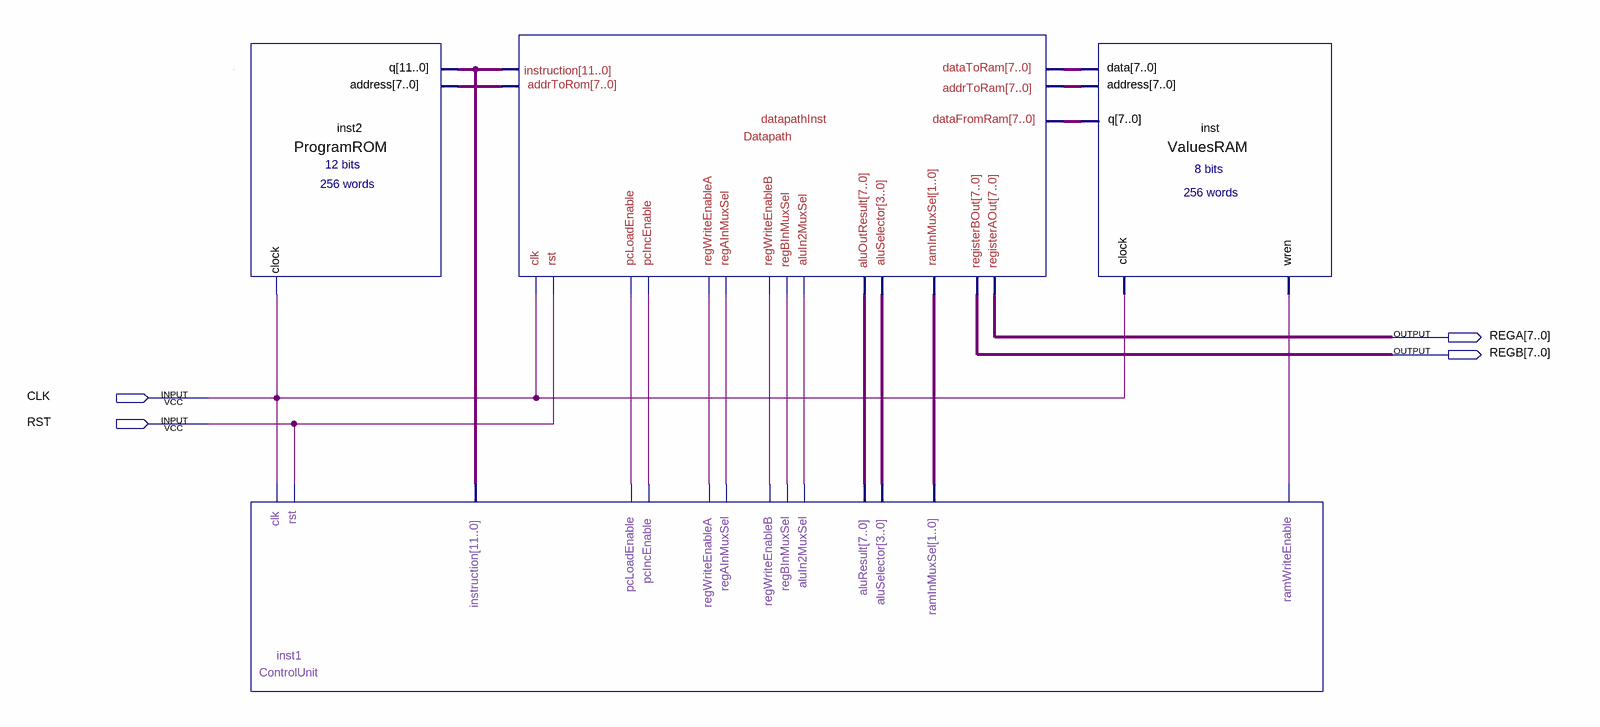
[diagram p0: schematic sheet]
// Quartus schematic TinyCore8.bdf as structural Verilog: 4 symbols, 4 pins
module TinyCore8 (
  input  CLK,
  input  RST,
  output [7:0] REGA,
  output [7:0] REGB
);

  wire inst1_aluin2muxsel, inst1_pcincenable, inst1_pcloadenable, inst1_ramwriteenable, inst1_regainmuxsel,
       inst1_regbinmuxsel, inst1_regwriteenablea, inst1_regwriteenableb;
  wire [1:0] inst1_raminmuxsel;
  wire [3:0] inst1_aluselector;
  wire [7:0] datapathInst_addrtoram, datapathInst_addrtorom, datapathInst_aluoutresult,
       datapathInst_datatoram, inst_q;
  wire [11:0] inst2_q;

  ProgramROM inst2 (.address(datapathInst_addrtorom), .clock(CLK), .q(inst2_q));
  ControlUnit inst1 (
    .instruction(inst2_q), .aluResult(datapathInst_aluoutresult), .clk(CLK), .rst(RST),
    .pcLoadEnable(inst1_pcloadenable), .pcIncEnable(inst1_pcincenable),
    .regWriteEnableA(inst1_regwriteenablea), .regWriteEnableB(inst1_regwriteenableb),
    .regAInMuxSel(inst1_regainmuxsel), .regBInMuxSel(inst1_regbinmuxsel), .aluIn2MuxSel(inst1_aluin2muxsel),
    .ramInMuxSel(inst1_raminmuxsel), .ramWriteEnable(inst1_ramwriteenable), .aluSelector(inst1_aluselector));
  Datapath datapathInst (
    .clk(CLK), .rst(RST), .instruction(inst2_q), .dataFromRam(inst_q), .pcLoadEnable(inst1_pcloadenable),
    .pcIncEnable(inst1_pcincenable), .regWriteEnableA(inst1_regwriteenablea),
    .regWriteEnableB(inst1_regwriteenableb), .regAInMuxSel(inst1_regainmuxsel),
    .regBInMuxSel(inst1_regbinmuxsel), .aluIn2MuxSel(inst1_aluin2muxsel), .ramInMuxSel(inst1_raminmuxsel),
    .aluSelector(inst1_aluselector), .addrToRom(datapathInst_addrtorom), .addrToRam(datapathInst_addrtoram),
    .dataToRam(datapathInst_datatoram), .aluOutResult(datapathInst_aluoutresult), .registerAOut(REGA),
    .registerBOut(REGB));
  ValuesRAM inst (
    .data(datapathInst_datatoram), .wren(inst1_ramwriteenable), .address(datapathInst_addrtoram),
    .clock(CLK), .q(inst_q));
endmodule
